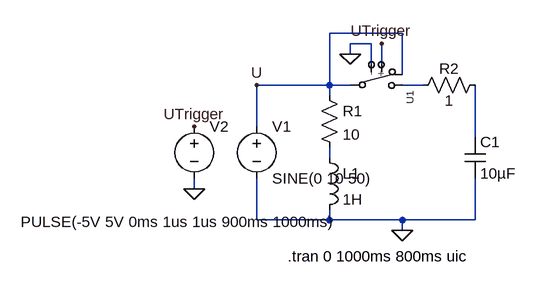
[diagram p0: schematic Blindleistungskompensation_Schalter.asc]
Blindleistungskompensation_Schalter.asc, the LTspice schematic file:
Version 4.1
SHEET 1 880 680
WIRE 64 -32 -48 -32
WIRE 16 -16 -16 -16
WIRE -16 0 -16 -16
WIRE 16 16 16 -16
WIRE 32 16 32 -16
WIRE 64 32 64 -32
WIRE -48 48 -48 -32
WIRE -48 48 -160 48
WIRE -16 48 -48 48
WIRE 96 48 64 48
WIRE -48 64 -48 48
WIRE -160 112 -160 48
WIRE 176 128 176 48
WIRE -48 160 -48 144
WIRE -256 208 -256 192
WIRE -160 256 -160 192
WIRE -48 256 -48 240
WIRE -48 256 -160 256
WIRE 64 256 -48 256
WIRE 176 256 176 192
WIRE 176 256 64 256
WIRE 64 272 64 256
FLAG -256 112 UTrigger
FLAG -256 208 0
FLAG -16 0 0
FLAG 32 -16 UTrigger
FLAG 64 272 0
FLAG -160 48 U
SYMBOL voltage -160 96 R0
WINDOW 123 0 0 Left 0
WINDOW 39 0 0 Left 0
SYMATTR InstName V1
SYMATTR Value SINE(0 10 50)
SYMBOL res -64 48 R0
SYMATTR InstName R1
SYMATTR Value 10
SYMBOL ind -64 144 R0
SYMATTR InstName L1
SYMATTR Value 1H
SYMBOL cap 160 128 R0
SYMATTR InstName C1
SYMATTR Value 10µF
SYMBOL voltage -256 96 R0
WINDOW 3 -267 163 Left 2
WINDOW 123 0 0 Left 0
WINDOW 39 0 0 Left 0
SYMATTR Value PULSE(-5V 5V 0ms 1us 1us 900ms 1000ms)
SYMATTR InstName V2
SYMBOL spdt2 16 64 R90
SYMATTR InstName U1
SYMBOL res 80 64 R270
WINDOW 0 26 56 VTop 2
WINDOW 3 8 56 VBottom 2
SYMATTR InstName R2
SYMATTR Value 1
TEXT -112 312 Left 2 !.tran 0 1000ms 800ms uic

The netlist it stands for:
* Blindleistungskompensation_Schalter.asc
V1 U 0 SINE(0 10 50)
R1 U N003 10
L1 N003 0 1H
C1 N002 0 10µF
V2 UTrigger 0 PULSE(-5V 5V 0ms 1us 1us 900ms 1000ms)
X§U1 U U N001 UTrigger 0 spdt2  ; pins COM NC NO + -
R2 N001 N002 1
.tran 0 1000ms 800ms uic
.lib spdt2.lib
.backanno
.end